# EAGLE design GWLSensorv2 (EAGLE 9.5.2)
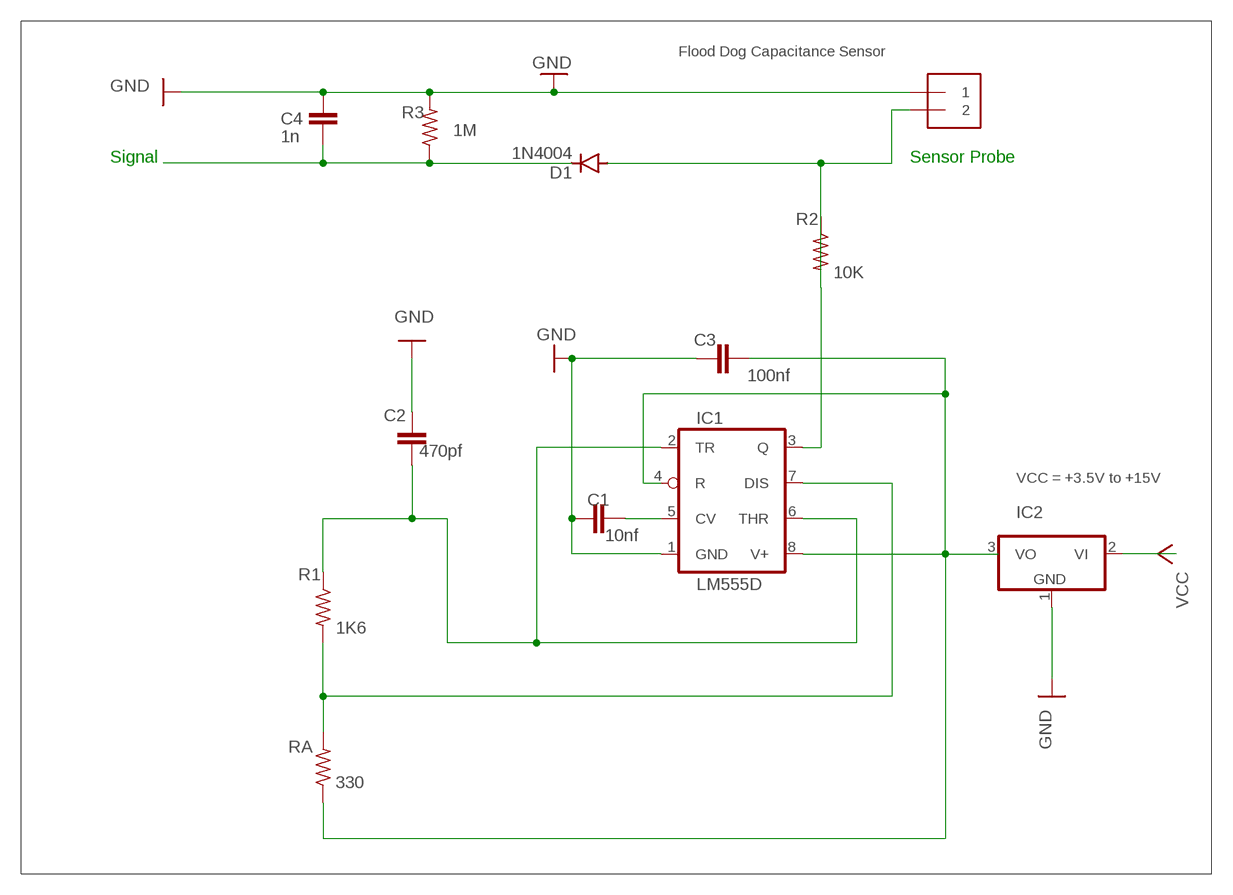
[diagram p0: schematic, sheet 1]

## Parts
C1  10nf  C-EUC0805  [C0805]
C2  470pf  C-EUC0805  [C0805]
C3  100nf  C-EUC0805  [C0805]
C4  1n  C-EUC0805  [C0805]
D1  1N4004  [DO41-10]
IC1  LM555D  [SO08]
IC2  79L15Z  [TO92]
J1  1X2-3.5MM  [1X2-3.5MM]
R1  1K6  R-US_R0805  [R0805]
R2  10K  R-US_R0805  [R0805]
R3  1M  R-US_R0805  [R0805]
RA  330  R-US_R0805  [R0805]

## Nets
GND: C1.1 C2.1 C3.1 C4.2 IC1.1(GND) IC2.1(GND) J1.1 R3.2
N$1: C4.1 D1.C R3.1
N$2: C2.2 IC1.2(TR) IC1.6(THR) R1.1
N$3: IC1.7(DIS) R1.2 RA.2
N$4: C1.2 IC1.5(CV)
N$5: D1.A IC1.3(Q) J1.2 R2.1 R2.2
N$6: C3.2 IC1.4(R) IC1.8(V+) IC2.3(VO) RA.1
VCC: IC2.2(VI)

## Notes on the sheet
- Flood Dog Capacitance Sensor
- Signal | Sensor Probe
- VCC = +3.5V to +15V

## Library data of the parts
C1-C4 = rcl:C-EU: CAPACITOR, European symbol
D1 = diode:1N4004: DIODE general purpose rectifier, 1 A
IC1 = linear:*555: TIMER
IC2 = linear:79*: Negative VOLTAGE REGULATOR
J1 = adafruit:1X2: 3.5mm Terminal block http://www.ladyada.net/library/pcb/eaglelibrary.html
R1-R3 RA = rcl:R-US_: RESISTOR, American symbol

## Board
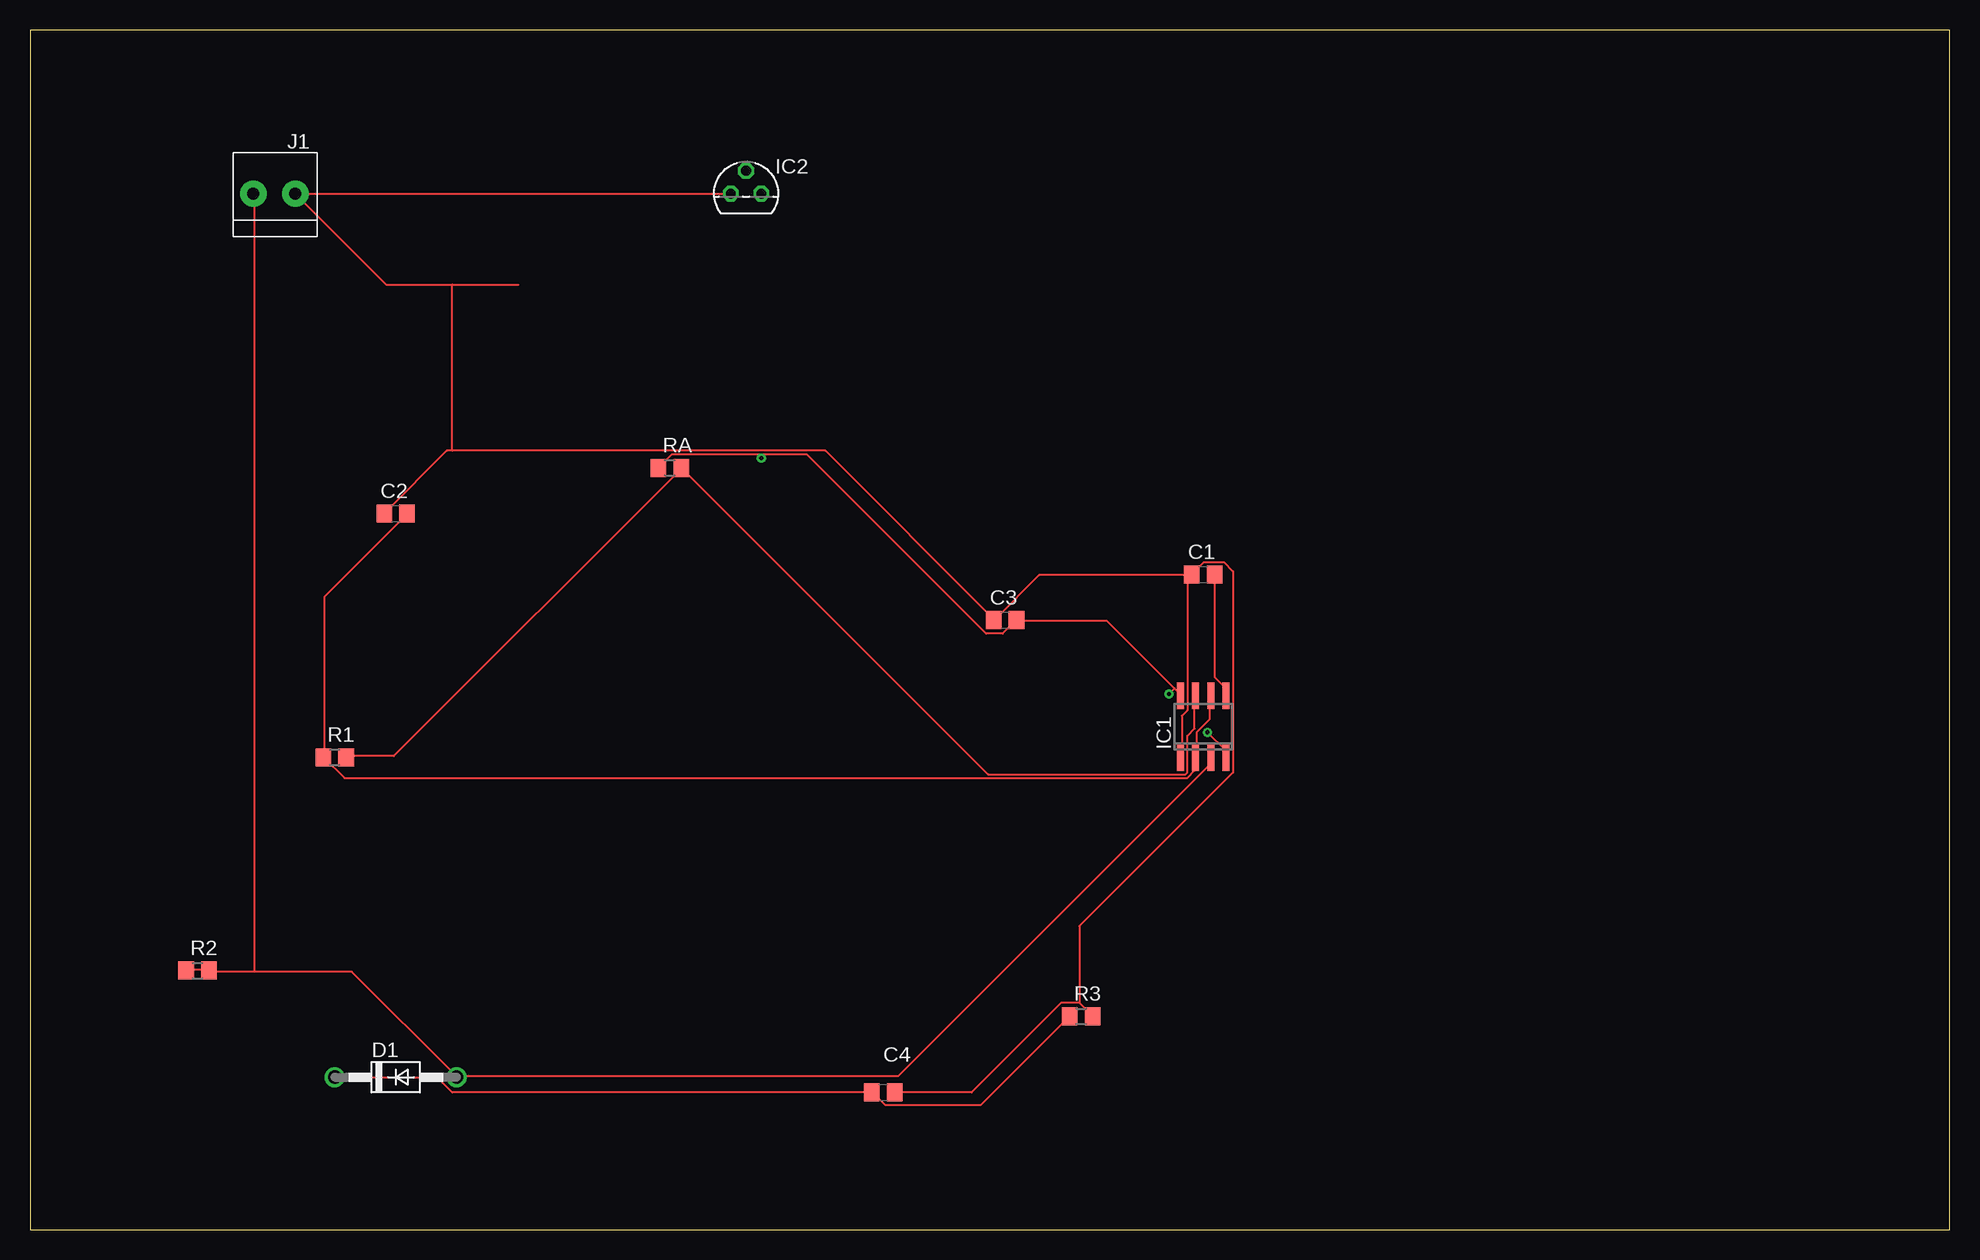
[diagram p1: board, top side]
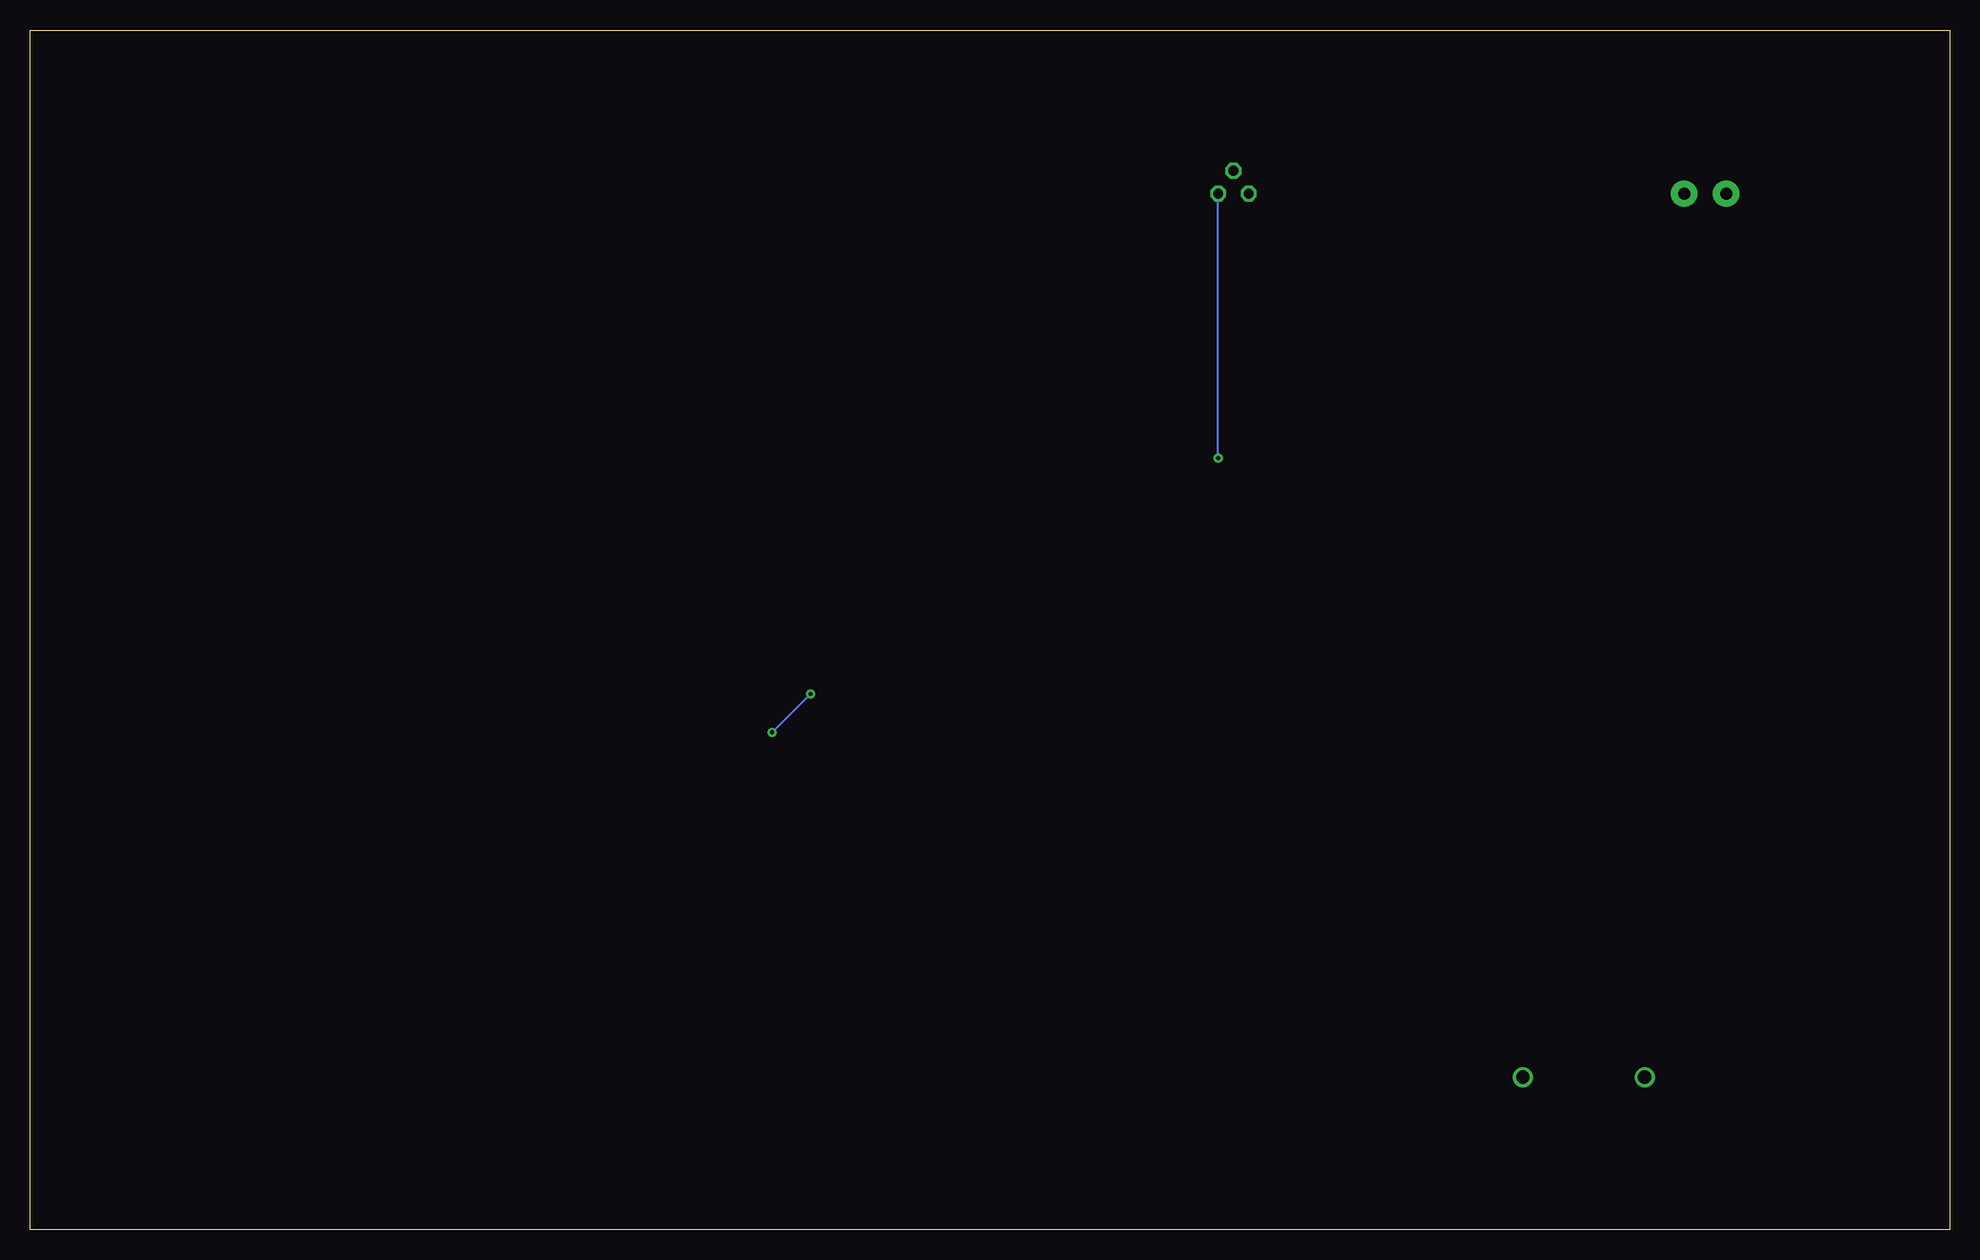
[diagram p2: board, bottom side, seen from below]

Size 160 x 100 mm. Coordinates in mm from the lower left corner, seen from the top.
Outline: 0,0 160,0 160,100 0,100 0,0
Copper layers (1*16): Top 0.035mm / dielectric 1.5mm / Bottom 0.035mm
Design rules "default": minimum track width 6mil, minimum drill 0.35mm, track to track 6mil, track to pad 6mil, pad to pad 6mil, via to via 6mil, smd to smd 6mil, copper to edge 40mil, drill to drill 6mil, minimum pad ring 10mil, minimum via ring 8mil, stop-mask expansion 4mil, vias tented up to drill 0mil, thermal gap 10mil

### Footprints (pad centres in the part's own frame; a part is rotated, then mirrored left to right if it is on the bottom)
C0805 = smd 1.3 x 1.5: 1 -0.95,0; 2 0.95,0
DO41-10 = drill 1.118: A 5.08,0; C -5.08,0
SO08 = smd 0.6 x 2.2: 1 -1.905,-2.6; 2 -0.635,-2.6; 3 0.635,-2.6; 4 1.905,-2.6; 5 1.905,2.6; 6 0.635,2.6; 7 -0.635,2.6; 8 -1.905,2.6
TO92 = drill 0.813 octagon: 1 -1.27,0; 2 0,1.905; 3 1.27,0
1X2-3.5MM = drill 1 pad 2.184: 1 1.8,0; 2 -1.7,0
R0805 = smd 1.3 x 1.5: 1 -0.95,0; 2 0.95,0

### Placement (x,y rotation side)
C1  97.79,54.61 0 top
C2  30.48,59.69 0 top
C3  81.28,50.8 0 top
C4  71.12,11.43 0 top
D1  30.48,12.7 0 top
IC1  97.79,41.91 0 top
IC2  59.69,86.36 0 top
J1  20.32,86.36 0 top
R1  25.4,39.37 0 top
R2  13.97,21.59 0 top
R3  87.63,17.78 0 top
RA  53.34,63.5 0 top

### Tracks (layer width: path | path; a pad name or v marks a point on that pad's centre or on a via)
GND
  Top 0.152: 96.47,54.56 96.77,54.56 C1.1 | 96.47,54.56 84.12,54.56 80.47,50.9 C3.1 80.31,50.9 66.29,64.92 35.2,64.92 | 96.47,54.56 96.47,43.28 96.01,42.82 96.01,39.32 IC1.1 | 96.47,54.56 C1.1 | IC2.1 J1.1 29.74,78.74 35.2,78.74 | 40.69,78.74 35.2,78.74 | C4.2 78.49,11.43 85.95,18.9 87.48,18.9 | 87.48,18.9 88.54,17.83 R3.2 | 35.2,64.92 34.75,64.92 29.57,59.74 C2.1 | 87.48,18.9 87.48,25.3 100.28,38.1 100.28,54.86 99.52,55.63 97.84,55.63 96.93,54.71 C1.1 | 35.2,64.92 35.2,78.74 | 35.2,78.79 35.2,78.74
N$1
  Top 0.152: R3.1 86.56,17.68 79.25,10.36 71.32,10.36 70.26,11.43 C4.1 35.2,11.43 33.98,12.65 25.45,12.65 D1.C
N$2
  Top 0.152: IC1.6 98.3,44.5 98.3,42.52 97.23,41.45 97.23,39.32 IC1.2 97.08,39.17 97.08,38.25 96.47,37.64 26.21,37.64 24.54,39.32 R1.1 24.54,39.47 24.54,52.73 31.39,59.59 C2.2
N$3
  Top 0.152: R1.2 26.36,39.47 30.33,39.47 54.25,63.4 RA.2 54.41,63.4 79.86,37.95 96.32,37.95 96.47,38.1 96.47,41.15 97.08,41.76 97.08,44.5 IC1.7
N$4
  Top 0.152: C1.2 98.75,54.56 98.75,46.02 99.67,45.11 99.67,44.65 IC1.5
N$5
  Top 0.152: R2.1 13.11,21.64 14.78,21.64 R2.2 14.94,21.49 18.75,21.49 | 18.75,21.49 26.82,21.49 35.51,12.8 D1.A 35.66,12.8 72.39,12.8 98.3,38.71 98.3,39.17 IC1.3 | 18.75,21.49 18.75,86.26 J1.2
N$6  (via drill 0.35)
  Top 0.152: 95.4,45.11 95.86,44.65 IC1.8 | 95.4,45.11 89.76,50.75 82.3,50.75 C3.2 82.14,50.75 81.08,49.68 79.7,49.68 64.77,64.62 60.96,64.62 | 60.96,64.62 53.49,64.62 52.43,63.55 RA.1 | v98.15,41.45 99.67,39.93 99.67,39.32 IC1.4 | 95.4,45.11 v94.94,44.65 | 60.96,64.62 v60.96,64.31
  Bottom 0.152: v94.94,44.65 v98.15,41.45 | v60.96,64.31 IC2.3